# EAGLE schematic T01_411_Synth_v3 (EAGLE 7.1.0)
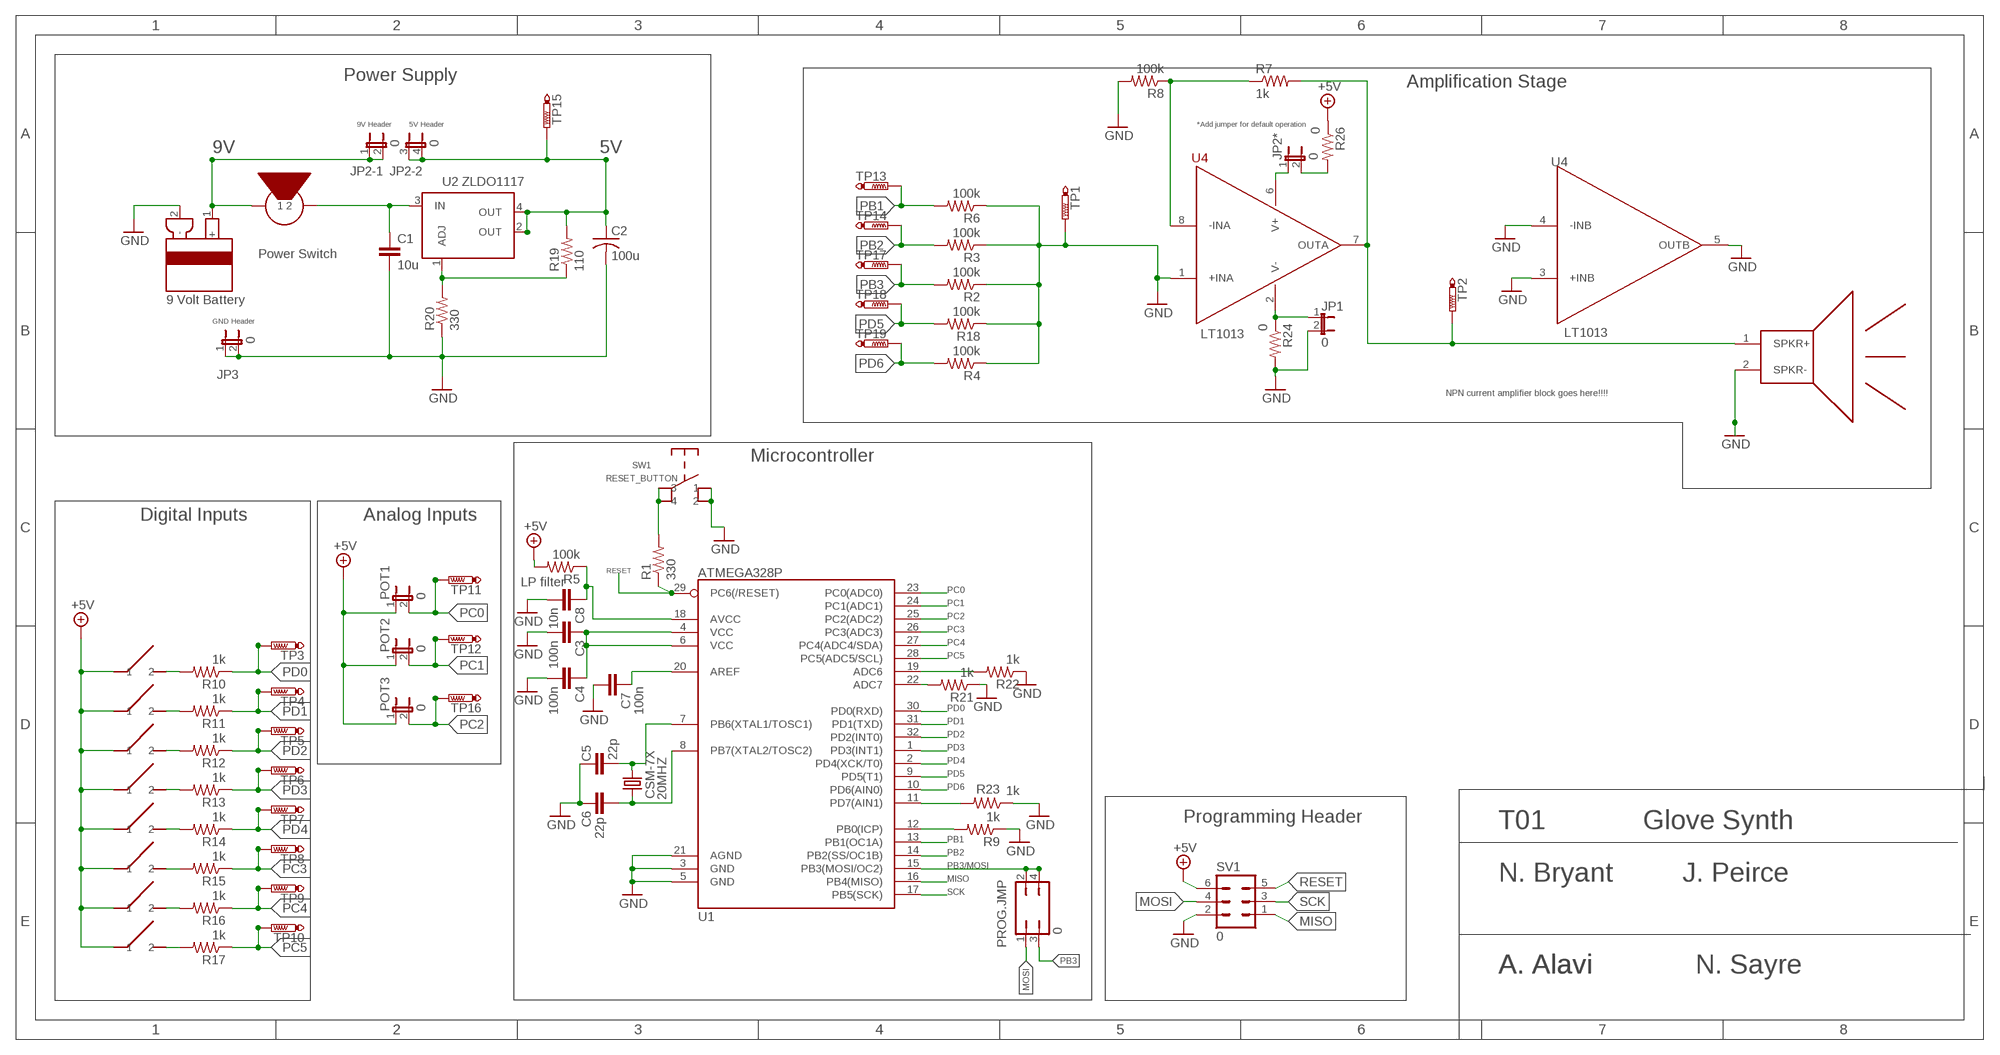
[diagram p0: schematic, sheet 1]

## Parts
20MHZ  CSM-7X  CSM-7X-DU  [CSM-7X-DU]
C1  10u  CAP0603-CAP  [0603-CAP]
C2  100u  C-US075-042X103  [C075-042X103]
C3  100n  CAP0603-CAP  [0603-CAP]
C4  100n  CAP0603-CAP  [0603-CAP]
C5  22p  CAP0603-CAP  [0603-CAP]
C6  22p  CAP0603-CAP  [0603-CAP]
C7  100n  CAP0603-CAP  [0603-CAP]
C8  10n  CAP0603-CAP  [0603-CAP]
JP1  0  JP1E  [JP1]
JP2  0  JP2QE  [JP2Q]
JP2*  0  JP1E  [JP1]
JP3  0  JP1E  [JP1]
POT1  0  JP1E  [JP1]
POT2  0  JP1E  [JP1]
POT3  0  JP1E  [JP1]
PROG.JMP  0  JP2Q  [JP2Q]
R1  330  RESISTOR0603  [0603-RES]
R2  100k  RESISTOR0603  [0603-RES]
R3  100k  RESISTOR0603  [0603-RES]
R4  100k  RESISTOR0603  [0603-RES]
R5  100k  RESISTOR0603  [0603-RES]
R6  100k  RESISTOR0603  [0603-RES]
R7  1k  RESISTOR0603  [0603-RES]
R8  100k  RESISTOR0603  [0603-RES]
R9  1k  RESISTOR0603  [0603-RES]
R10  1k  RESISTOR0603  [0603-RES]
R11  1k  RESISTOR0603  [0603-RES]
R12  1k  RESISTOR0603  [0603-RES]
R13  1k  RESISTOR0603  [0603-RES]
R14  1k  RESISTOR0603  [0603-RES]
R15  1k  RESISTOR0603  [0603-RES]
R16  1k  RESISTOR0603  [0603-RES]
R17  1k  RESISTOR0603  [0603-RES]
R18  100k  RESISTOR0603  [0603-RES]
R19  110  RESISTOR0603  [0603-RES]
R20  330  RESISTOR0603  [0603-RES]
R21  1k  RESISTOR0603  [0603-RES]
R22  1k  RESISTOR0603  [0603-RES]
R23  1k  RESISTOR0603  [0603-RES]
R24  0  RESISTOR0603  [0603-RES]
R26  0  RESISTOR0603  [0603-RES]
SV1  0  MA03-2  [MA03-2]
SW1  RESET_BUTTON  [RESET_BUTTON]
TP1  PTR1B2,54  [B2,54]
TP2  PTR1B2,54  [B2,54]
TP3  PTR1B2,54  [B2,54]
TP4  PTR1B2,54  [B2,54]
TP5  PTR1B2,54  [B2,54]
TP6  PTR1B2,54  [B2,54]
TP7  PTR1B2,54  [B2,54]
TP8  PTR1B2,54  [B2,54]
TP9  PTR1B2,54  [B2,54]
TP10  PTR1B2,54  [B2,54]
TP11  PTR1B2,54  [B2,54]
TP12  PTR1B2,54  [B2,54]
TP13  PTR1B2,54  [B2,54]
TP14  PTR1B2,54  [B2,54]
TP15  PTR1B2,54  [B2,54]
TP16  PTR1B2,54  [B2,54]
TP17  PTR1B2,54  [B2,54]
TP18  PTR1B2,54  [B2,54]
TP19  PTR1B2,54  [B2,54]
U1  ATMEGA328P  ATMEGA328_SMT  [TQFP32-08]
U2  ZLDO1117  [SOT223]
U4  LT1013  [SO08]
U$1  SPEAKER  [JP1]
U$7  POWER_SWITCH  [JP1]
U$8  9VOLTBATTERY  [JP1]
U$11  FINGER_BUTTON  [JP1]
U$12  FINGER_BUTTON  [JP1]
U$13  FINGER_BUTTON  [JP1]
U$14  FINGER_BUTTON  [JP1]
U$15  FINGER_BUTTON  [JP1]
U$16  FINGER_BUTTON  [JP1]
U$17  FINGER_BUTTON  [JP1]
U$18  FINGER_BUTTON  [JP1]

## Nets
5V: C2.1 JP2.3 JP2.4 R19.2 TP15.TP U2.2(OUT) U2.4(OUT)
9V: JP2.1 JP2.2 U$7.1 U$8.1(+)
+5V: POT1.1 POT2.1 POT3.1 R5.2 R26.1 SV1.6 U$11.1 U$12.1 U$13.1 U$14.1 U$15.1 U$16.1 U$17.1 U$18.1
GND: C1.2 C2.2 C3.2 C4.2 C5.2 C6.2 C7.2 C8.2 JP1.2 JP3.1 JP3.2 R2.1 R3.1 R4.1 R6.1 R8.2 R9.1 R18.1 R20.1 R21.1 R22.1 R23.1 R24.2 SV1.2 SW1.1 SW1.2 TP1.TP U1.3(GND) U1.5(GND) U1.21(AGND) U4.1(+INA) U4.3(+INB) U4.4(-INB) U4.5(OUTB) U$1.2(SPKR-) U$8.2(-)
MISO: SV1.1 U1.16(PB4(MISO))
MOSI: PROG.JMP.1 SV1.4
N$1: C7.1 U1.20(AREF)
N$2: C3.1 C4.1 U1.4(VCC) U1.6(VCC)
N$3: R10.2 U$18.2
N$4: R11.2 U$17.2
N$5: R12.2 U$16.2
N$6: 20MHZ.1 C5.1 U1.7(PB6(XTAL1/TOSC1))
N$7: 20MHZ.2 C6.1 U1.8(PB7(XTAL2/TOSC2))
N$8: C8.1 R5.1 U1.18(AVCC)
N$9: R21.2 U1.22(ADC7)
N$10: R22.2 U1.19(ADC6)
N$11: R13.2 U$15.2
N$12: R14.2 U$14.2
N$13: R16.2 U$12.2
N$14: R15.2 U$13.2
N$15: R17.2 U$11.2
N$16: R7.1 R8.1 U4.8(-INA)
N$17: R9.2 U1.12(PB0(ICP))
N$20: JP2*.2 R26.2
N$22: R1.2 SW1.3 SW1.4
N$34: R7.2 TP2.TP U4.7(OUTA) U$1.1(SPKR+)
N$37: R19.1 R20.2 U2.1(ADJ)
N$38: C1.1 U2.3(IN) U$7.2
PB1: R6.2 TP13.TP U1.13(PB1(OC1A))
PB2: R3.2 TP14.TP U1.14(PB2(SS/OC1B))
PB3: PROG.JMP.3 R2.2 TP17.TP
PB3/MOSI: PROG.JMP.2 PROG.JMP.4 U1.15(PB3(MOSI/OC2))
PC0: POT1.2 TP11.TP U1.23(PC0(ADC0))
PC1: POT2.2 TP12.TP U1.24(PC1(ADC1))
PC2: POT3.2 TP16.TP U1.25(PC2(ADC2))
PC3: R15.1 TP8.TP U1.26(PC3(ADC3))
PC4: R16.1 TP9.TP U1.27(PC4(ADC4/SDA))
PC5: R17.1 TP10.TP U1.28(PC5(ADC5/SCL))
PD0: R10.1 TP3.TP U1.30(PD0(RXD))
PD1: R11.1 TP4.TP U1.31(PD1(TXD))
PD2: R12.1 TP5.TP U1.32(PD2(INT0))
PD3: R13.1 TP6.TP U1.1(PD3(INT1))
PD4: R14.1 TP7.TP U1.2(PD4(XCK/T0))
PD5: R18.2 TP18.TP U1.9(PD5(T1))
PD6: R4.2 TP19.TP U1.10(PD6(AIN0))
PD7: R23.2 U1.11(PD7(AIN1))
RESET: R1.1 SV1.5 U1.29(PC6(/RESET))
SCK: SV1.3 U1.17(PB5(SCK))
V+: JP2*.1 U4.6(V+)
V-: JP1.1 R24.1 U4.2(V-)

## Notes on the sheet
- Power Supply
- Amplification Stage
- 9V Header | 5V Header | *Add jumper for default operation
- Power Switch
- GND Header
- NPN current amplifier block goes here!!!!
- Microcontroller
- Digital Inputs | Analog Inputs
- LP filter
- Programming Header
- T01 | Glove Synth
- N. Bryant | J. Peirce
- A. Alavi | A. Alavi | N. Sayre

## Library data of the parts
20MHZ = crystal:CSM-7X-DU: SMD CRYSTAL Source: www.ecsxtal.com .. Crystal 3.6864MHz CSM_7X_DU.PDF; OC_FARNELL: unknown; OC_NEWARK: unknown
C1 C3-C8 = SparkFun-Capacitors:CAP: Capacitor Standard 0603 ceramic capacitor, and 0.1" leaded capacitor.
C2 = adafruit:C-US: CAPACITOR, American symbol
JP1 JP2* JP3 POT1-POT3 = jumper:JP1E: JUMPER
JP2 = jumper:JP2QE: JUMPER
PROG.JMP = jumper:JP2Q: JUMPER
R1-R24 R26 = SparkFun-Resistors:RESISTOR: Resistor Basic schematic elements and footprints for 0603, 1206, and PTH resistors.
SV1 = con-lstb:MA03-2: PIN HEADER; OC_FARNELL: unknown; OC_NEWARK: unknown
SW1 = Synth_Glove:RESET_BUTTON
TP1-TP19 = testpad:PTR1: TEST PIN
U1 = SparkFun-DigitalIC:ATMEGA328_SMT: 32-Pin Atmega328 part Commonly used on Arduino compatible boards Available in QFP and QFN packages TQFP is IC-09069 QFN is non-stock; PROD_ID: IC-09069
U2 = Synth_Glove:ZLDO1117
U4 = Synth_Glove:LT1013: Linear Technology dual input precision op amps
U$1 = Synth_Glove:SPEAKER
U$7 = Synth_Glove:POWER_SWITCH
U$8 = Synth_Glove:9VOLTBATTERY
U$11-U$18 = Synth_Glove:FINGER_BUTTON: Finger contact button for T01 Synthesizer glove project